# Altium schematic sheet 液晶板.SchDoc
size A4
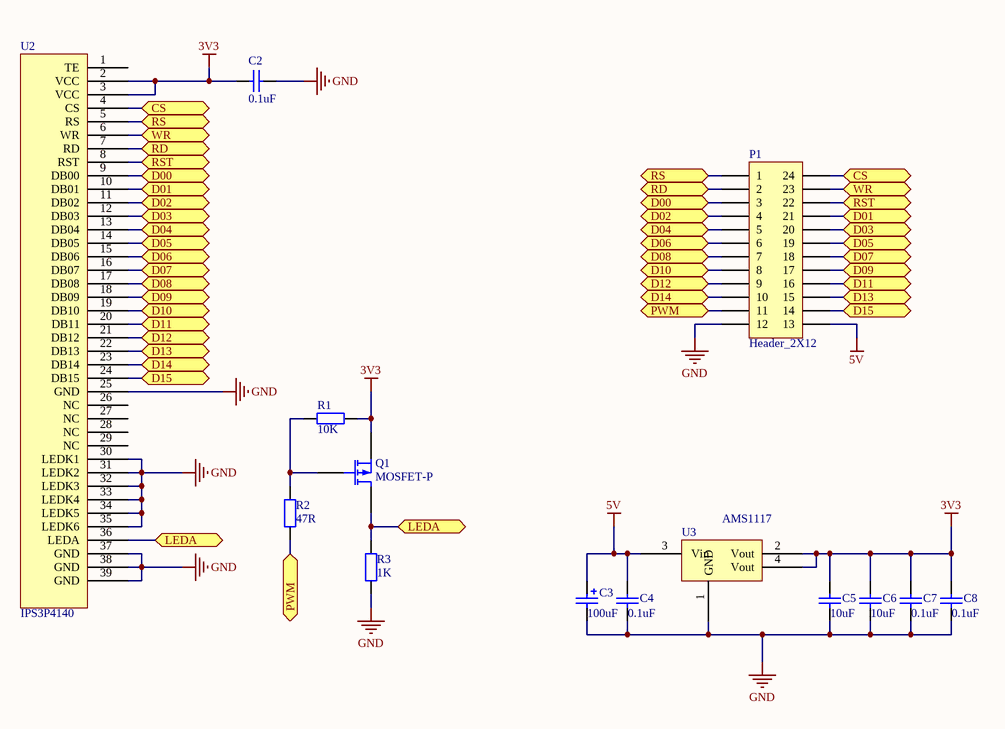
[diagram p0: 液晶板.SchDoc]

## Parts
C2  value 0.1uF  [1608[0603]]  (hidden comment: Cap Semi)
C3  value 100uF  [3528]  (hidden comment: Cap Pol2)
C4  value 0.1uF  [1608[0603]]  (hidden comment: Cap Semi)
C5  value 10uF  [1608[0603]]  (hidden comment: Cap Semi)
C6  value 10uF  [1608[0603]]  (hidden comment: Cap Semi)
C7  value 0.1uF  [1608[0603]]  (hidden comment: Cap Semi)
C8  value 0.1uF  [1608[0603]]  (hidden comment: Cap Semi)
P1  Header_2X12  [HDR2X12]
Q1  MOSFET-P  [SOT23_N]
R1  value 10K  [1608[0603]]  (hidden comment: Res2)
R2  value 47R  [1608[0603]]  (hidden comment: Res2)
R3  value 1K  [1608[0603]]  (hidden comment: Res2)
U2  IPS3P4140  [FH26-39S-0.3SHW]
U3  AMS1117  [SOT223]

## Ports
CS, D00, D01, D02, D03, D04, D05, D06, D07, D08, D09, D10, D11, D12, D13, D14, D15, LEDA, PWM, RD, RS, RST, WR

## Nets
3V3: C2.2 C5.2 C6.2 C7.2 C8.2 Q1.3(S) R1.1 U2.2(VCC) U2.3(VCC) U3.2(Vout) U3.4(Vout)
5V: C3.1 C4.2 P1.13 U3.3(Vin)
GND: C2.1 C3.2 C4.1 C5.1 C6.1 C7.1 C8.1 P1.12 R3.1 U2.25(GND) U2.30(LEDK1) U2.31(LEDK2) U2.32(LEDK3) U2.33(LEDK4) U2.34(LEDK5) U2.35(LEDK6) U2.37(GND) U2.38(GND) U2.39(GND) U3.1(GND)
CS: P1.24 U2.4(CS) ; port CS
D00: P1.3 U2.9(DB00) ; port D00
D01: P1.21 U2.10(DB01) ; port D01
D02: P1.4 U2.11(DB02) ; port D02
D03: P1.20 U2.12(DB03) ; port D03
D04: P1.5 U2.13(DB04) ; port D04
D05: P1.19 U2.14(DB05) ; port D05
D06: P1.6 U2.15(DB06) ; port D06
D07: P1.18 U2.16(DB07) ; port D07
D08: P1.7 U2.17(DB08) ; port D08
D09: P1.17 U2.18(DB09) ; port D09
D10: P1.8 U2.19(DB10) ; port D10
D11: P1.16 U2.20(DB11) ; port D11
D12: P1.9 U2.21(DB12) ; port D12
D13: P1.15 U2.22(DB13) ; port D13
D14: P1.10 U2.23(DB14) ; port D14
D15: P1.14 U2.24(DB15) ; port D15
LEDA: Q1.1(D) R3.2 U2.36(LEDA) ; port LEDA
PWM: P1.11 R2.2 ; port PWM
RD: P1.2 U2.7(RD) ; port RD
RS: P1.1 U2.5(RS) ; port RS
RST: P1.22 U2.8(RST) ; port RST
WR: P1.23 U2.6(WR) ; port WR
NetQ1_2: Q1.2(G) R1.2 R2.1

Not connected (* = marked no-connect by the designer): U2 1(TE) 26(NC) 27(NC) 28(NC) 29(NC)

## Library data of the parts
C2 C4-C8 = Cap Semi: Capacitor (Semiconductor SIM Model); Published: 8-Jun-2000; LatestRevisionDate: 29-May-2009; LatestRevisionNote: IPC-7351 Footprint Added.; PackageReference: C1206; Publisher: Altium Limited; PackageDescription: Chip Capacitor
C3 = Cap Pol2: Polarized Capacitor (Axial); Published: 8-Jun-2000; LatestRevisionDate: 17-Jul-2002; LatestRevisionNote: Re-released for DXP Platform.; PackageReference: POLAR0.8; Publisher: Altium Limited; PackageDescription: Polarized Capacitor; 2 Leads
Q1 = MOSFET-P: P-Channel MOSFET; Published: 8-Jun-2000; LatestRevisionDate: 17-Jul-2002; LatestRevisionNote: Re-released for DXP Platform.; PackageVersion: 1995/1996; PackageReference: E3; Publisher: Altium Limited; PackageDescription: TO, Flat Index; 3 In-Line, Axial Leads; Body Dia. 4.6mm; Lead Dia. 0.5 mm (max)
R1-R3 = Res2: Resistor; Published: 8-Jun-2000; LatestRevisionDate: 17-Jul-2002; LatestRevisionNote: Re-released for DXP Platform.; PackageReference: AXIAL-0.4; Publisher: Altium Limited; PackageDescription: Axial Device, Thru-Hole; 2 Leads; 0.4 in Pin Spacing
U2 = IPS3P4140: IPS液晶显示屏
U3 = AMS1117: 稳压IC